# Altium project xecanbang.PrjPcb
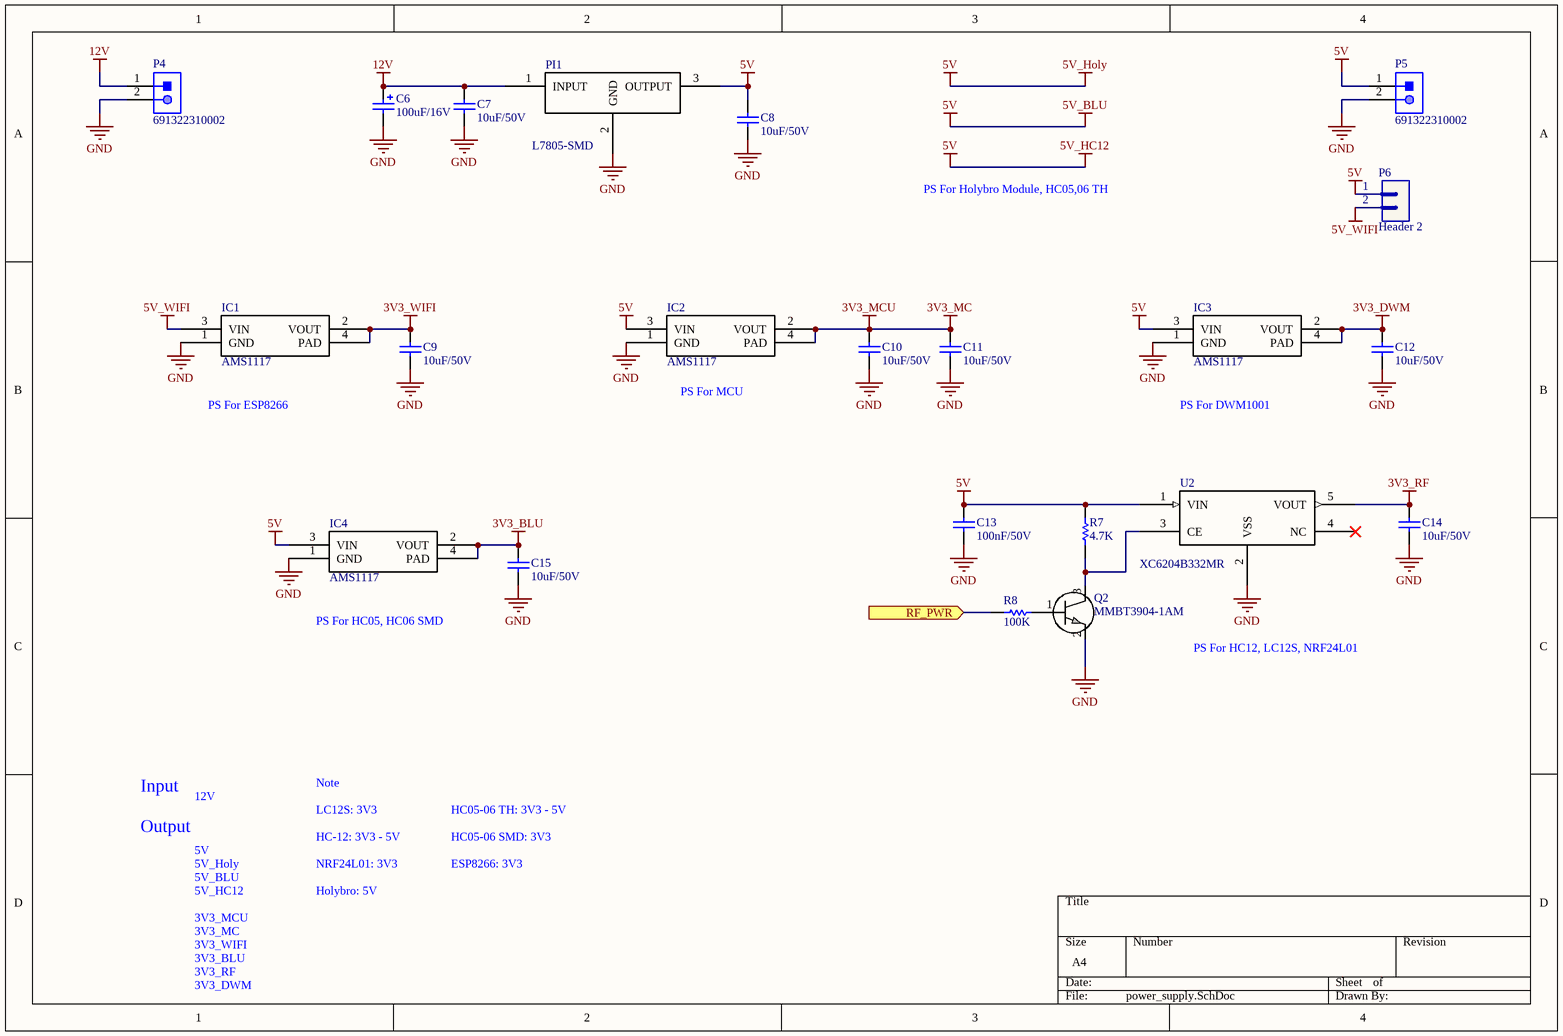
[diagram p0: power_supply.SchDoc]
8 sheets, 147 parts. Net scope: flat (ports and power ports of the same name join across sheets).
Board file: projectxecanbang.PcbDoc
Sheets:
  power_supply.SchDoc
  MCU.SchDoc
  Sensor.SchDoc
  Motor Control.SchDoc
  Bluetooth.SchDoc
  RF.SchDoc
  Decawave.SchDoc
  Wifi.SchDoc

## Sheet power_supply.SchDoc
size A4; DocumentNumber: 1; SheetNumber: 1; SheetTotal: 2

### Parts
(Parts that share a designator on the sheet are numbered #1, #2 ... from top to bottom, then left to right.)
C6  value 100uF/16V  [CAP-SM-AL-SIZE-D-D6L6]  (hidden comment: Cap-Al-100uF-16V-D6L5)
C7  value 10uF/50V  [CAP-SM-0805]  (hidden comment: Cap-10uF-50V-0805)
C8  value 10uF/50V  [CAP-SM-0805]  (hidden comment: Cap-10uF-50V-0805)
C9  value 10uF/50V  [CAP-SM-0805]  (hidden comment: Cap-10uF-50V-0805)
C10  value 10uF/50V  [CAP-SM-0805]  (hidden comment: Cap-10uF-50V-0805)
C11  value 10uF/50V  [CAP-SM-0805]  (hidden comment: Cap-10uF-50V-0805)
C12  value 10uF/50V  [CAP-SM-0805]  (hidden comment: Cap-10uF-50V-0805)
C13  value 100nF/50V  [CAP-SM-0805]  (hidden comment: Cap-100nF-50V-0805)
C14  value 10uF/50V  [CAP-SM-0805]  (hidden comment: Cap-10uF-50V-0805)
C15  value 10uF/50V  [CAP-SM-0805]  (hidden comment: Cap-10uF-50V-0805)
IC1  AMS1117  [SOT223_AMS111700]
IC2  AMS1117  [SOT223_AMS111700]
IC3  AMS1117  [SOT223_AMS111700]
IC4  AMS1117  [SOT223_AMS111700]
P4#1  691322310002  [691322310002]
P5#1  691322310002  [691322310002]
P6#1  Header 2  [JP2]
PI1  L7805-SMD  [D2PAK]
Q2  MMBT3904-1AM  [SOT23_NEX]
R7  value 4.7K  [RES-SM-0805]  (hidden comment: Res-4.7K-0805)
R8  value 100K  [RES-SM-0805]  (hidden comment: Res-100K-0805)
U2  XC6204B332MR  [XC6204/05_SOT-25]

### Ports
RF_PWR (in)

### Nets
3V3_BLU: C15.2 IC4.2(VOUT) IC4.4(PAD)
3V3_DWM: C12.2 IC3.2(VOUT) IC3.4(PAD)
3V3_MC: C10.2 C11.2 IC2.2(VOUT) IC2.4(PAD)  [also labelled 3V3_MCU]
3V3_RF: C14.2 U2.5(VOUT)
3V3_WIFI: C9.2 IC1.2(VOUT) IC1.4(PAD)
5V: C8.2 C13.2 IC2.3(VIN) IC3.3(VIN) IC4.3(VIN) P5#1.1 P6#1.1 PI1.3(OUTPUT) R7.2 U2.1(VIN)  [also labelled 5V_BLU, 5V_HC12, 5V_Holy]
5V_WIFI: IC1.3(VIN) P6#1.2
12V: C6.1 C7.2 P4#1.1 PI1.1(INPUT)
GND: C6.2 C7.1 C8.1 C9.1 C10.1 C11.1 C12.1 C13.1 C14.1 C15.1 IC1.1(GND) IC2.1(GND) IC3.1(GND) IC4.1(GND) P4#1.2 P5#1.2 PI1.2(GND) Q2.2 U2.2(VSS)
NetQ2_1: Q2.1 R8.2
NetQ2_3: Q2.3 R7.1 U2.3(CE)
NetR8_1: R8.1 ; port RF_PWR

Not connected (* = marked no-connect by the designer): U2 4(NC)*

### Notes on the sheet
- PS For Holybro Module, HC05,06 TH
- PS For ESP8266
- (near IC2) PS For MCU
- PS For DWM1001
- PS For HC05, HC06 SMD
- PS For HC12, LC12S, NRF24L01
- Note
- Input
- Output
- 12V
- LC12S: 3V3
- HC-12: 3V3 - 5V
- HC05-06 TH: 3V3 - 5V
- HC05-06 SMD: 3V3
- 5V
  5V_Holy
  5V_BLU
  5V_HC12
- NRF24L01: 3V3
- Holybro: 5V
- ESP8266: 3V3
- 3V3_MCU
  3V3_MC
  3V3_WIFI
  3V3_BLU
  3V3_RF
  3V3_DWM

### Library data of the parts
C6 = Cap-Al-100uF-16V-D6L5: CAP ALUM 100UF 20% 16V SMD; Manufacturer: Nichicon; Manufacturer Part Number: UWX1C101MCL1GB; Local Supplier: thegioiic; Local Supplier Link: https://thegioiic.com/products/tu-nhom-smd-100uf-16v-d6-3l5-4; Supplier 1: Digikey; Supplier 1 Part Number: 493-2105-1-ND; Supplier 1 Link: https://www.digikey.com/product-detail/en/nichicon/UWX1C101MCL1GB/493-2105-1-ND/590080
C7-C12 C14 C15 = Cap-10uF-50V-0805: CAP CER 10UF 50V X5R 0805; Manufacturer: Yageo; Manufacturer Part Number: CC0805KKX5R9BB106; Local Supplier: thegioiic; Local Supplier Link: https://thegioiic.com/products/tu-10uf-50v-0805; Supplier 1: Digikey; Supplier 1 Link: https://www.digikey.com/product-detail/en/yageo/CC0805KKX5R9BB106/311-3499-2-ND/7164383; Supplier 1 Part Number: 311-3499-2-ND
C13 = Cap-100nF-50V-0805: CAP CER 0.1UF 50V Y5V 0805; Manufacturer: Samsung Electro-Mechanics; Manufacturer Part Number: CL21F104ZBCNNNC; Local Supplier: thegioiic; Local Supplier Link: https://thegioiic.com/products/tu-100nf-0-1uf-50v-0805; Supplier 1: Digikey; Supplier 1 Part Number: 1276-1007-1-ND; Supplier 1 Link: https://www.digikey.com/product-detail/en/samsung-electro-mechanics/CL21F104ZBCNNNC/1276-1007-1-ND/3889093
IC1-IC4 = AMS1117: Manufacturer_Part_Number: AMS1117-5.0; SourceLibrary: Advanced_Monolithic_Systems_2020-02-13; Built_By: EMA_Kyle; Vendor: Advanced Monolithic Systems; Copyright: Copyright (C) 2018 Accelerated Designs. All rights reserved; RefDes: RefDes; Type: DEV
P4#1 P5#1 = 691322310002: WR-TBL Serie 322 Horizontal PCB Header, Pluggable, pitch 3.81mm, 2p; Compliance: RoHS; Modularity: No; Pin Number: 2; Rated Current [UL]: 10A; Working Voltage [UL]: 300VAC; ComponentLink1Description: Manufacturer; ComponentLink1URL: http://www.we-online.de; ComponentLink2URL: https://katalog.we-online.de/em/datasheet/691322310002.pdf; ComponentLink2Description: Datasheet; Mounting Technology: THT; Part Number: 691322310002; Packaging: Box; Operating Temperature: -40 to +105degC; PCB/Cable/Panel: PCB; Pitch: 3.81mm; Published Date: October 2019; Type: Horizontal; Publisher: Wurth Elektronik; Application: Pluggable
P6#1 = Header 2: Header, 2-Pin; LatestRevisionDate: 17-Jul-2002; LatestRevisionNote: Re-released for DXP Platform.; Publisher: Altium Limited
PI1 = L7805-SMD: Manufacturer_Part_Number: L7805CD2T-TR; Vendor: STMicroelectronics; Built_By: EMA_UL_Team; Copyright: Copyright (C) 2018 Accelerated Designs. All rights reserved; RefDes: RefDes; Type: DEV
Q2 = MMBT3904-1AM: Vendor: Nexperia; SourceLibrary: Nexperia_2018-05-2018; Type: DEV; Manufacturer_Part_Number: MMBT3904; Copyright: Copyright (C) 2016 Accelerated Designs. All rights reserved; RefDes: RefDes
R7 = Res-4.7K-0805: RES SMD 4.7K OHM 5% 1/8W 0805; Manufacturer: Yageo; Manufacturer Part Number: RC0805JR-074K7L; Local Supplier: thegioiic; Local Supplier Link: https://thegioiic.com/products/dien-tro-4-7k-ohm-0805-5; Supplier 1: Digikey; Supplier 1 Link: https://www.digikey.com/product-detail/en/yageo/RC0805JR-074K7L/311-4.7KARCT-ND/731274; Supplier 1 Part Number: 311-4.7KARCT-ND
R8 = Res-100K-0805: RES 0 OHM JUMPER 0805; Manufacturer: Vishay Dale; Manufacturer Part Number: WSL080500000ZEA9; Local Supplier: thegioiic; Local Supplier Link: https://thegioiic.com/products/dien-tro-0-ohm-0805-5; Supplier 1: Digikey; Supplier 1 Link: https://www.digikey.com/product-detail/en/vishay-dale/WSL080500000ZEA9/541-3928-1-ND/7423223; Supplier 1 Part Number: 541-3928-1-ND
U2 = XC6204B332MR: Vendor: Torex Semiconductor; Built_By: EMA_UL_Team; SourceLibrary: Torex_2016-07-05_1; Manufacturer_Part_Number: XC6204B332MR; Copyright: Copyright (C) 2018 Accelerated Designs. All rights reserved; RefDes: RefDes; Type: DEV

## Sheet MCU.SchDoc
size A4; DocumentNumber: 2; SheetNumber: 2; SheetTotal: 2
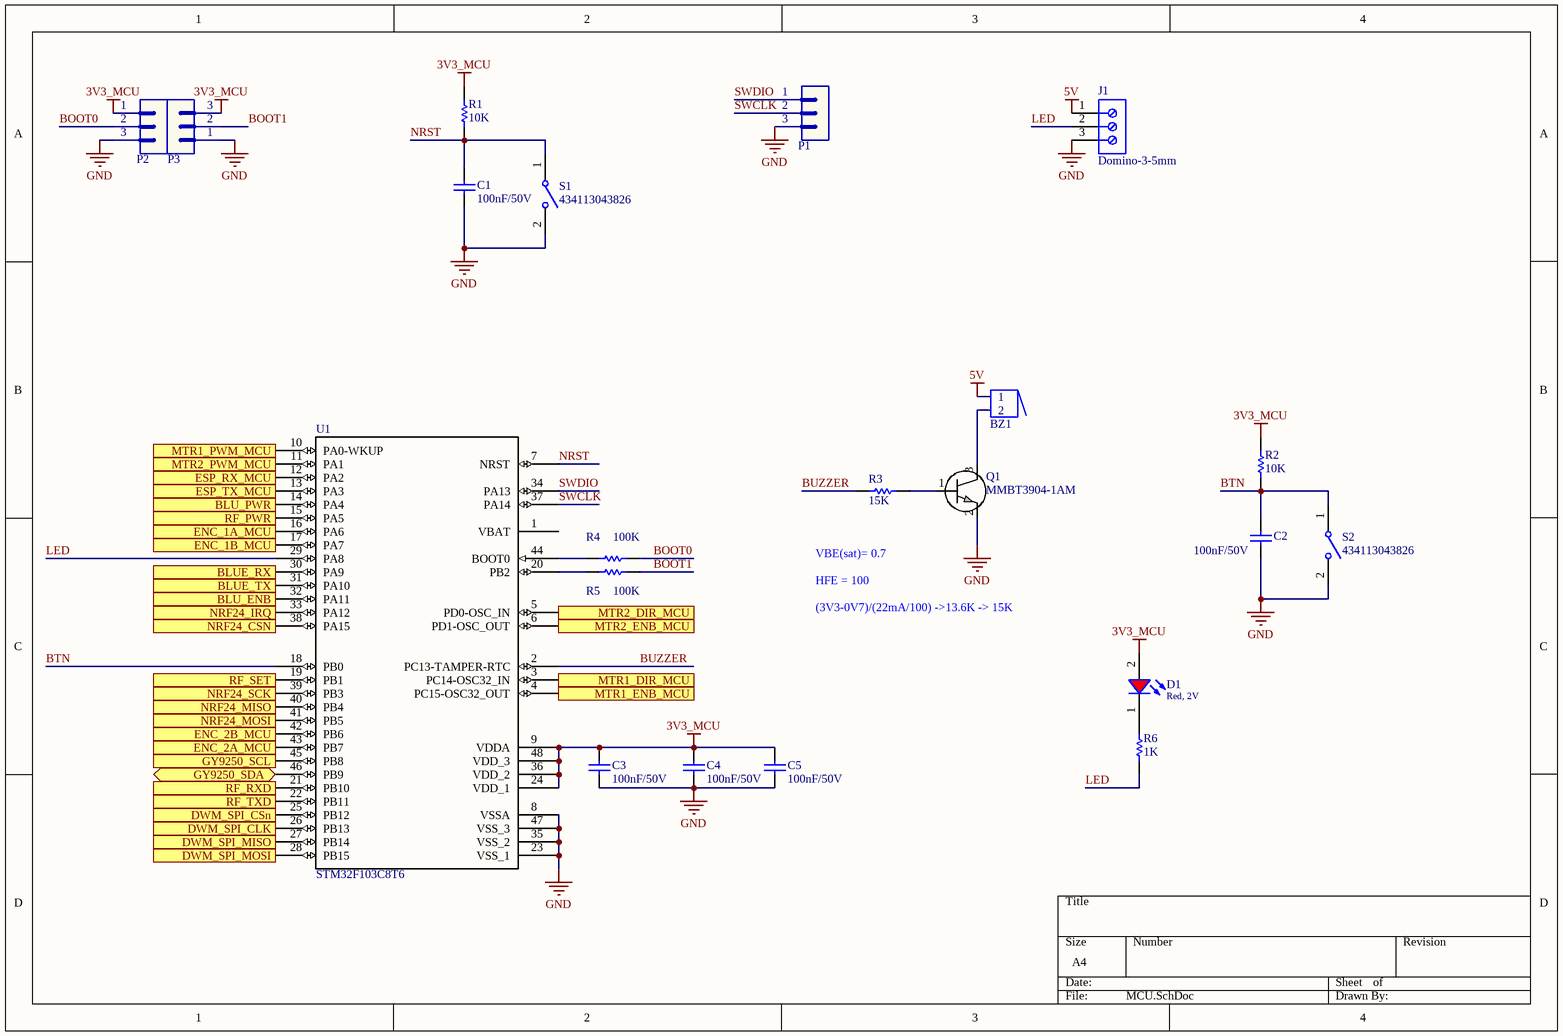
[diagram p1: MCU.SchDoc]

### Parts
BZ1  Buzzer  [BUZZER]  (value not drawn)
C1  value 100nF/50V  [CAP-SM-0805]  (hidden comment: Cap-100nF-50V-0805)
C2  value 100nF/50V  [CAP-SM-0805]  (hidden comment: Cap-100nF-50V-0805)
C3  value 100nF/50V  [CAP-SM-0805]  (hidden comment: Cap-100nF-50V-0805)
C4  value 100nF/50V  [CAP-SM-0805]  (hidden comment: Cap-100nF-50V-0805)
C5  value 100nF/50V  [CAP-SM-0805]  (hidden comment: Cap-100nF-50V-0805)
D1  Red, 2V  [WL-SMCW_0805]
J1  Domino-3-5mm  [DOMINO-3-5mm]
P1  Header 3  [JP3]  (value not drawn)
P2  Header 3  [JP3]  (value not drawn)
P3  Header 3  [JP3]  (value not drawn)
Q1  MMBT3904-1AM  [SOT23_NEX]
R1  value 10K  [RES-SM-0805]  (hidden comment: Res-10k-0805)
R2  value 10K  [RES-SM-0805]  (hidden comment: Res-10k-0805)
R3  value 15K  [RES-SM-0805]  (hidden comment: Res-15K-0805)
R4  value 100K  [RES-SM-0805]  (hidden comment: Res-100K-0805)
R5  value 100K  [RES-SM-0805]  (hidden comment: Res-100K-0805)
R6  value 1K  [RES-SM-0805]  (hidden comment: Res-1K-0805)
S1  434113043826  [434113043826]
S2  434113043826  [434113043826]
U1  STM32F103C8T6  [STM32F103T8C6]

### Ports
BLU_ENB (out), BLU_PWR (out), BLUE_RX (out), BLUE_TX (in), DWM_SPI_CLK (out), DWM_SPI_CSn (out), DWM_SPI_MISO (in), DWM_SPI_MOSI (out), ENC_1A_MCU (in), ENC_1B_MCU (in), ENC_2A_MCU (in), ENC_2B_MCU (in), ESP_RX_MCU (out), ESP_TX_MCU (in), GY9250_SCL (out), GY9250_SDA (bidir), MTR1_DIR_MCU (out), MTR1_ENB_MCU (out), MTR1_PWM_MCU (out), MTR2_DIR_MCU (out), MTR2_ENB_MCU (out), MTR2_PWM_MCU (out), NRF24_CSN (out), NRF24_IRQ (in), NRF24_MISO (in), NRF24_MOSI (out), NRF24_SCK (out), RF_PWR (out), RF_RXD (out), RF_SET (out), RF_TXD (in)

### Nets
3V3_MCU: C3.1 C4.1 C5.1 D1.2(A) P2.1 P3.3 R1.1 R2.2 U1.9(VDDA) U1.24(VDD_1) U1.36(VDD_2) U1.48(VDD_3)  [project net 3V3_MC]
5V: BZ1.1 J1.1
GND: C1.1 C2.1 C3.2 C4.2 C5.2 J1.3 P1.3 P2.3 P3.1 Q1.2 S1.2 S2.2 U1.8(VSSA) U1.23(VSS_1) U1.35(VSS_2) U1.47(VSS_3)
BOOT0: P2.2 R4.2
BOOT1: P3.2 R5.2
BTN: C2.2 R2.1 S2.1 U1.18(PB0)
BUZZER: R3.1 U1.2(PC13-TAMPER-RTC)
DWM_SPI_CLK: U1.26(PB13) ; port DWM_SPI_CLK
DWM_SPI_CSn: U1.25(PB12) ; port DWM_SPI_CSn
DWM_SPI_MISO: U1.27(PB14) ; port DWM_SPI_MISO
DWM_SPI_MOSI: U1.28(PB15) ; port DWM_SPI_MOSI
ESP_TX: U1.13(PA3) ; port ESP_TX_MCU
LED: J1.2 R6.2 U1.29(PA8)
NRST: C1.2 R1.2 S1.1 U1.7(NRST)
RF_RXD: U1.21(PB10) ; port RF_RXD
RF_SET: U1.19(PB1) ; port RF_SET
RF_TXD: U1.22(PB11) ; port RF_TXD
SWCLK: P1.2 U1.37(PA14)
SWDIO: P1.1 U1.34(PA13)
NetBZ1_2: BZ1.2 Q1.3
NetD1_1: D1.1(K) R6.1
NetH1_2: U1.30(PA9) ; port BLUE_RX
NetH1_3: U1.31(PA10) ; port BLUE_TX
NetH1_6: U1.32(PA11) ; port BLU_ENB
NetM1_3: U1.45(PB8) ; port GY9250_SCL
NetM1_4: U1.46(PB9) ; port GY9250_SDA
NetM6_4: U1.38(PA15) ; port NRF24_CSN
NetM6_5: U1.39(PB3) ; port NRF24_SCK
NetM6_6: U1.41(PB5) ; port NRF24_MOSI
NetM6_7: U1.40(PB4) ; port NRF24_MISO
NetM6_8: U1.33(PA12) ; port NRF24_IRQ
NetQ1_1: Q1.1 R3.2
NetR4_1: R4.1 U1.44(BOOT0)
NetR5_1: R5.1 U1.20(PB2)
NetR8_1: U1.15(PA5) ; port RF_PWR
NetR27_1: U1.12(PA2) ; port ESP_RX_MCU
NetU1_3: U1.3(PC14-OSC32_IN) ; port MTR1_DIR_MCU
NetU1_4: U1.4(PC15-OSC32_OUT) ; port MTR1_ENB_MCU
NetU1_5: U1.5(PD0-OSC_IN) ; port MTR2_DIR_MCU
NetU1_6: U1.6(PD1-OSC_OUT) ; port MTR2_ENB_MCU
NetU1_10: U1.10(PA0-WKUP) ; port MTR1_PWM_MCU
NetU1_11: U1.11(PA1) ; port MTR2_PWM_MCU
NetU1_14: U1.14(PA4) ; port BLU_PWR
NetU1_16: U1.16(PA6) ; port ENC_1A_MCU
NetU1_17: U1.17(PA7) ; port ENC_1B_MCU
NetU1_42: U1.42(PB6) ; port ENC_2B_MCU
NetU1_43: U1.43(PB7) ; port ENC_2A_MCU

Not connected (* = marked no-connect by the designer): U1 1(VBAT)

### Notes on the sheet
- VBE(sat)= 0.7
- HFE = 100
- (3V3-0V7)/(22mA/100) ->13.6K -> 15K

### Library data of the parts
C1-C5 = Cap-100nF-50V-0805: as C13 on sheet power_supply; Local Supplier: thegioiic; Local Supplier Link: https://thegioiic.com/products/tu-100nf-0-1uf-50v-0805; Supplier 1: Digikey; Supplier 1 Part Number: 1276-1007-1-ND; Supplier 1 Link: https://www.digikey.com/product-detail/en/samsung-electro-mechanics/CL21F104ZBCNNNC/1276-1007-1-ND/3889093
D1 = 150080RS75000: WL-SMCW SMT Mono-color Chip LED Waterclear, size 0805, Red, 2V, 140deg; Chip Technology: AlInGaP; Dominant Wavelength typ.: 625nm; Luminous Intensity typ.: 150mcd; Peak Wavelength typ.: 630nm; Viewing Angle: 140deg; ComponentLink1Description: Manufacturer; ComponentLink1URL: http://www.we-online.de; ComponentLink2URL: https://www.we-online.com/catalog/datasheet/150080RS75000.pdf; ComponentLink2Description: Datasheet; Forward Voltage typ.: 2V; Emitting Color: Red; Mounting Technology: SMT; Operating Temperature: -40 to +85degC; Published Date: December 2019; Part Number: 150080RS75000; Packaging: Tape and Reel; Size: 0805; Publisher: Wurth Elektronik
J1 = Domino-3-5mm: WR-TBL Serie 1347 Horizontal Cable Entry, Pressure Clamp, pitch 5mm, 3p; Part Number: 691134710003; Compliance: Lead free / RoHS; Modularity: Yes; PCB/Cable/Panel: PCB; Pin Number: 3; Rated Current [UL]: 16A; Working Voltage [UL]: 300VAC; ComponentLink1Description: Manufacturer; ComponentLink1URL: http://www.we-online.de; ComponentLink2URL: https://katalog.we-online.de/em/datasheet/691134710003.pdf; ComponentLink2Description: Datasheet; Mounting Technology: THT; Packaging: Box; Operating Temperature: -30 to +120degC; Pitch: 5mm; Published Date: October 2019; Type: Horizontal; Publisher: Wurth Elektronik; Application: Pressure Clamp
P1-P3 = Header 3: Header, 3-Pin; LatestRevisionDate: 17-Jul-2002; LatestRevisionNote: Re-released for DXP Platform.; Publisher: Altium Limited
Q1 = MMBT3904-1AM: as Q2 on sheet power_supply; Manufacturer_Part_Number: MMBT3904; Copyright: Copyright (C) 2016 Accelerated Designs. All rights reserved; RefDes: RefDes
R1 R2 = Res-10k-0805: RES 10K OHM 1% 1/4W 0805; Manufacturer: Stackpole Electronics Inc; Manufacturer Part Number: RNCP0805FTD10K0; Local Supplier: thegioiic; Local Supplier Link: https://thegioiic.com/products/dien-tro-10k-ohm-0805-5; Supplier 1: Digikey; Supplier 1 Link: https://www.digikey.com/product-detail/en/stackpole-electronics-inc/RNCP0805FTD10K0/RNCP0805FTD10K0CT-ND/2240601; Supplier 1 Part Number: RNCP0805FTD10K0CT-ND
R3 = Res-15K-0805: RES 15K OHM 1% 1/4W 0805; Manufacturer: TE Connectivity Passive Product; Manufacturer Part Number: CRGCQ0805F15K; Local Supplier: thegioiic; Local Supplier Link: https://thegioiic.com/products/dien-tro-15k-ohm-0805-1; Supplier 1: Digikey; Supplier 1 Part Number: A129763CT-ND; Supplier 1 Link: https://www.digikey.com/product-detail/en/te-connectivity-passive-product/CRGCQ0805F15K/A129763CT-ND/8577595
R4 R5 = Res-100K-0805: as R8 on sheet power_supply; Local Supplier: thegioiic; Local Supplier Link: https://thegioiic.com/products/dien-tro-0-ohm-0805-5; Supplier 1: Digikey; Supplier 1 Link: https://www.digikey.com/product-detail/en/vishay-dale/WSL080500000ZEA9/541-3928-1-ND/7423223; Supplier 1 Part Number: 541-3928-1-ND
R6 = Res-1K-0805: RES 1K OHM 1% 1/4W 0805; Manufacturer: Stackpole Electronics Inc; Manufacturer Part Number: RNCP0805FTD1K00; Local Supplier: thegioiic; Local Supplier Link: https://thegioiic.com/products/dien-tro-1k-ohm-0805-5; Supplier 1: Digikey; Supplier 1 Link: https://www.digikey.com/product-detail/en/stackpole-electronics-inc/RNCP0805FTD1K00/RNCP0805FTD1K00CT-ND/2240568; Supplier 1 Part Number: RNCP0805FTD1K00CT-ND
S1 S2 = 434113043826: WS-TASV J-Bend SMT Tact Switch 6x3.5mm, height 4.3mm, 260gf; Rated Voltage: 12VDC; Rated Current: 50mA; Washable: No; ComponentLink1Description: Manufacturer; ComponentLink1URL: http://www.we-online.de; ComponentLink2Description: Datasheet; ComponentLink2URL: https://katalog.we-online.com/em/datasheet/434113043826.pdf; Operating Temperature: -40 to +85degC; Part Number: 434113043826; Published Date: September 2019; Contact Material: Stainless Steel; Height: 4.3mm; Mounting Technology: SMT; Contact Plating: Silver; Operation Force: 260gf; Packaging: Tape and Reel; Terminal Material: Copper Alloy; Publisher: Wurth Elektronik; Terminal Plating: Silver
U1 = STM32F103C8T6: Vendor: STMicroelectronics; Built_By: EMA_UL_Team; Manufacturer_Part_Number: STM32F103C8T6; Copyright: Copyright (C) 2018 Accelerated Designs. All rights reserved; RefDes: RefDes; Type: DEV

## Sheet Sensor.SchDoc
size A4
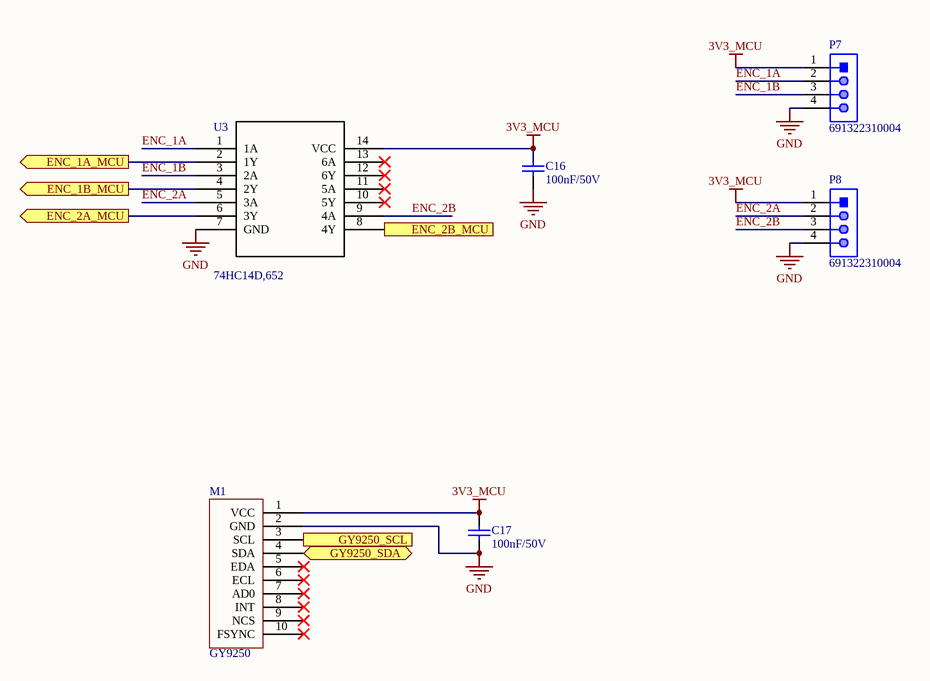
[diagram p2: Sensor.SchDoc]

### Parts
(Parts that share a designator on the sheet are numbered #1, #2 ... from top to bottom, then left to right.)
C16  value 100nF/50V  [CAP-SM-0805]  (hidden comment: Cap-100nF-50V-0805)
C17  value 100nF/50V  [CAP-SM-0805]  (hidden comment: Cap-100nF-50V-0805)
M1  GY9250  [GY9250]
P7#1  691322310004  [691322310004]
P8#1  691322310004  [691322310004]
U3  74HC14D,652  [74HC14D,652]

### Ports
ENC_1A_MCU (out), ENC_1B_MCU (out), ENC_2A_MCU (out), ENC_2B_MCU (out), GY9250_SCL (in), GY9250_SDA (bidir)

### Nets
3V3_MCU: C16.2 C17.2 M1.1(VCC) P7#1.1 P8#1.1 U3.14(VCC)  [project net 3V3_MC]
GND: C16.1 C17.1 M1.2(GND) P7#1.4 P8#1.4 U3.7(GND)
ENC_1A: P7#1.2 U3.1(1A)
ENC_1B: P7#1.3 U3.3(2A)
ENC_2A: P8#1.2 U3.5(3A)
ENC_2B: P8#1.3 U3.9(4A)
NetM1_3: M1.3(SCL) ; port GY9250_SCL
NetM1_4: M1.4(SDA) ; port GY9250_SDA
NetU1_16: U3.2(1Y) ; port ENC_1A_MCU
NetU1_17: U3.4(2Y) ; port ENC_1B_MCU
NetU1_42: U3.8(4Y) ; port ENC_2B_MCU
NetU1_43: U3.6(3Y) ; port ENC_2A_MCU

Not connected (* = marked no-connect by the designer): M1 5(EDA)* 6(ECL)* 7(AD0)* 8(INT)* 9(NCS)* 10(FSYNC)*; U3 10(5Y)* 11(5A)* 12(6Y)* 13(6A)*

### Library data of the parts
C16 C17 = Cap-100nF-50V-0805: as C13 on sheet power_supply; Local Supplier: thegioiic; Local Supplier Link: https://thegioiic.com/products/tu-100nf-0-1uf-50v-0805; Supplier 1: Digikey; Supplier 1 Part Number: 1276-1007-1-ND; Supplier 1 Link: https://www.digikey.com/product-detail/en/samsung-electro-mechanics/CL21F104ZBCNNNC/1276-1007-1-ND/3889093
P7#1 P8#1 = 691322310004: WR-TBL Serie 322 Horizontal PCB Header, Pluggable, pitch 3.81mm, 4p; Compliance: RoHS; Modularity: No; Pin Number: 4; Rated Current [UL]: 10A; Working Voltage [UL]: 300VAC; ComponentLink1Description: Manufacturer; ComponentLink1URL: http://www.we-online.de; ComponentLink2URL: https://katalog.we-online.de/em/datasheet/691322310004.pdf; ComponentLink2Description: Datasheet; Mounting Technology: THT; Part Number: 691322310004; Packaging: Box; Operating Temperature: -40 to +105degC; PCB/Cable/Panel: PCB; Pitch: 3.81mm; Published Date: October 2019; Type: Horizontal; Publisher: Wurth Elektronik; Application: Pluggable
U3 = 74HC14D,652: Vendor: Nexperia; SourceLibrary: Nexperia_2018-05-2018; Manufacturer_Part_Number: 74HC14D,652; Copyright: Copyright (C) 2016 Accelerated Designs. All rights reserved; RefDes: RefDes; Type: DEV
M1 = GY9250: Local Supplier: HShop; Local Supplier Link: https://hshop.vn/products/cam-bien-gy-9250-9dof-imu-mpu9250; Local Supplier Part Number: *; Manufacturer: *; Manufacturer Part Number: *

## Sheet Motor Control.SchDoc
size A4
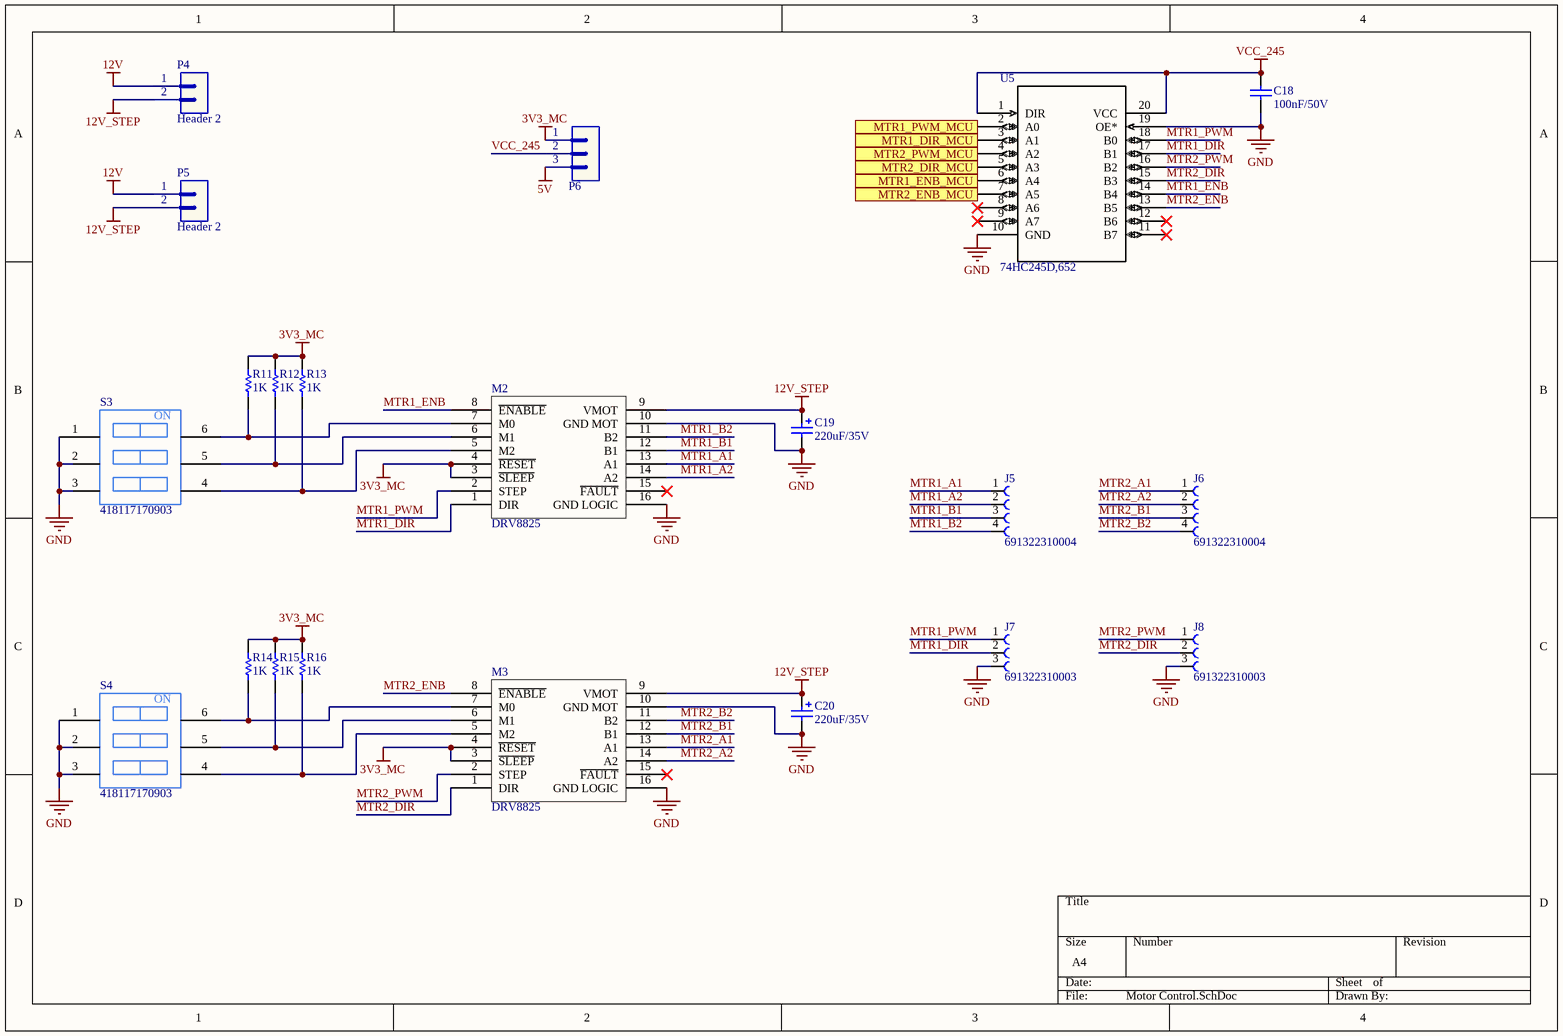
[diagram p3: Motor Control.SchDoc]

### Parts
(Parts that share a designator on the sheet are numbered #1, #2 ... from top to bottom, then left to right.)
C18  value 100nF/50V  [CAP-SM-0805]  (hidden comment: Cap-100nF-50V-0805)
C19  value 220uF/35V  [CAP-SM-AL-SIZE-F-D8L10]  (hidden comment: Cap-Al-220uF-35V-D8L10)
C20  value 220uF/35V  [CAP-SM-AL-SIZE-F-D8L10]  (hidden comment: Cap-Al-220uF-35V-D8L10)
J5  691322310004  [691322310004]
J6  691322310004  [691322310004]
J7  691322310003  [691322310003]
J8  691322310003  [691322310003]
M2  DRV8825  [DRV8825]
M3  DRV8825  [DRV8825]
P4#2  Header 2  [JP2]
P5#2  Header 2  [JP2]
P6#2  Header 3  [JP3]  (value not drawn)
R11  value 1K  [RES-SM-0805]  (hidden comment: Res-1K-0805)
R12  value 1K  [RES-SM-0805]  (hidden comment: Res-1K-0805)
R13  value 1K  [RES-SM-0805]  (hidden comment: Res-1K-0805)
R14  value 1K  [RES-SM-0805]  (hidden comment: Res-1K-0805)
R15  value 1K  [RES-SM-0805]  (hidden comment: Res-1K-0805)
R16  value 1K  [RES-SM-0805]  (hidden comment: Res-1K-0805)
S3  418117170903  [418117170903]
S4  418117170903  [418117170903]
U5  74HC245D,652  [74HC245D-652]

### Ports
MTR1_DIR_MCU (in), MTR1_ENB_MCU (in), MTR1_PWM_MCU (in), MTR2_DIR_MCU (in), MTR2_ENB_MCU (in), MTR2_PWM_MCU (in)

### Nets
3V3_MC: M2.3(~{SLEEP}) M2.4(~{RESET}) M3.3(~{SLEEP}) M3.4(~{RESET}) P6#2.1 R11.2 R12.2 R13.2 R14.2 R15.2 R16.2
5V: P6#2.3
12V: P4#2.1 P5#2.1
12V_STEP: C19.1 C20.1 M2.9(VMOT) M3.9(VMOT) P4#2.2 P5#2.2
GND: C18.1 C19.2 C20.2 J7.3 J8.3 M2.10(GND_MOT) M2.16(GND_LOGIC) M3.10(GND_MOT) M3.16(GND_LOGIC) U5.10(GND) U5.19(OE*)
VCC_245: C18.2 P6#2.2 U5.1(DIR) U5.20(VCC)
MTR1_A1: J5.1 M2.13(A1)
MTR1_A2: J5.2 M2.14(A2)
MTR1_B1: J5.3 M2.12(B1)
MTR1_B2: J5.4 M2.11(B2)
MTR1_DIR: J7.2 M2.1(DIR) U5.17(B1)
MTR1_ENB: M2.8(~{ENABLE}) U5.14(B4)
MTR1_PWM: J7.1 M2.2(STEP) U5.18(B0)
MTR2_A1: J6.1 M3.13(A1)
MTR2_A2: J6.2 M3.14(A2)
MTR2_B1: J6.3 M3.12(B1)
MTR2_B2: J6.4 M3.11(B2)
MTR2_DIR: J8.2 M3.1(DIR) U5.15(B3)
MTR2_ENB: M3.8(~{ENABLE}) U5.13(B5)
MTR2_PWM: J8.1 M3.2(STEP) U5.16(B2)
NetM2_5: M2.5(M2) R13.1
NetM2_6: M2.6(M1) R12.1
NetM2_7: M2.7(M0) R11.1
NetM3_5: M3.5(M2) R16.1
NetM3_6: M3.6(M1) R15.1
NetM3_7: M3.7(M0) R14.1
NetU1_3: U5.3(A1) ; port MTR1_DIR_MCU
NetU1_4: U5.6(A4) ; port MTR1_ENB_MCU
NetU1_5: U5.5(A3) ; port MTR2_DIR_MCU
NetU1_6: U5.7(A5) ; port MTR2_ENB_MCU
NetU1_10: U5.2(A0) ; port MTR1_PWM_MCU
NetU1_11: U5.4(A2) ; port MTR2_PWM_MCU

Not connected (* = marked no-connect by the designer): M2 15(~{FAULT})*; M3 15(~{FAULT})*; S3 1 2 3 4 5 6; S4 1 2 3 4 5 6; U5 8(A6)* 9(A7)* 11(B7)* 12(B6)*

### Notes on the sheet
- (in symbol 418117170903) ON

### Library data of the parts
C18 = Cap-100nF-50V-0805: as C13 on sheet power_supply; Local Supplier: thegioiic; Local Supplier Link: https://thegioiic.com/products/tu-100nf-0-1uf-50v-0805; Supplier 1: Digikey; Supplier 1 Part Number: 1276-1007-1-ND; Supplier 1 Link: https://www.digikey.com/product-detail/en/samsung-electro-mechanics/CL21F104ZBCNNNC/1276-1007-1-ND/3889093
C19 C20 = Cap-Al-220uF-35V-D8L10: CAP ALUM 220UF 20% 35V SMD; Manufacturer: Nichicon; Manufacturer Part Number: UWT1V221MNL1GS; Local Supplier: thegioiic; Local Supplier Link: https://thegioiic.com/products/tu-nhom-smd-220uf-35v-d8l10; Supplier 1: Digikey; Supplier 1 Link: https://www.digikey.com/product-detail/en/nichicon/UWT1V221MNL1GS/493-2205-2-ND/589946; Supplier 1 Part Number: 493-2205-2-ND
J5 J6 = 691322310004: 4 Position Terminal Block Header, Male Pins, Shrouded (4 Side) 0.150 (3.81mm) 90Â°, Right Angle Through Hole; MF: Wurth Electronics; Package: None; DigiKey-Purchase-URL: https://snapeda.com/shop?store=DigiKey&id=1195122; Value: *; MP: 691322310004; Availability: Unavailable; SnapEDA_Link: https://www.snapeda.com/parts/691322310004/Wurth%20Electronics%20Inc./view-part/1195122/?ref=snap; Price: None
J7 J8 = 691322310003: 3 Position Terminal Block Header, Male Pins, Shrouded _4 Side_ 0.150 _3.81mm_ 90Â°, Right Angle Through Hole; MF: Wurth Electronics; Availability: Unavailable; SnapEDA_Link: https://www.snapeda.com/parts/691322310003/Wurth%20Electronics%20Inc./view-part/1195121/?ref=snap; MP: 691322310003; Price: None; Package: None; DigiKey-Purchase-URL: https://snapeda.com/shop?store=DigiKey&id=1195121; Value: *
P4#2 P5#2 = Header 2: Header, 2-Pin; LatestRevisionDate: 17-Jul-2002; LatestRevisionNote: Re-released for DXP Platform.; Publisher: Altium Limited
P6#2 = Header 3: Header, 3-Pin; LatestRevisionDate: 17-Jul-2002; LatestRevisionNote: Re-released for DXP Platform.; Publisher: Altium Limited
R11-R16 = Res-1K-0805: as R6 on sheet MCU; Local Supplier: thegioiic; Local Supplier Link: https://thegioiic.com/products/dien-tro-1k-ohm-0805-5; Supplier 1: Digikey; Supplier 1 Link: https://www.digikey.com/product-detail/en/stackpole-electronics-inc/RNCP0805FTD1K00/RNCP0805FTD1K00CT-ND/2240568; Supplier 1 Part Number: RNCP0805FTD1K00CT-ND
U5 = 74HC245D,652: Vendor: Nexperia; SourceLibrary: Nexperia_2018-05-2018; Manufacturer_Part_Number: 74HC245D,652; Copyright: Copyright (C) 2016 Accelerated Designs. All rights reserved; RefDes: RefDes; Type: DEV
M2 M3 = DRV8825: Local Supplier: NShop; Local Supplier Link: https://nshopvn.com/product/mach-dieu-khien-dong-co-buoc-drv8825/?gclid=Cj0KCQjwrIf3BRD1ARIsAMuugNvhHaPvOoXKOe7yuk1AcgXaHXv0JlSPYKOD4P10-tIEuNTPRK5zkgEaAjhjEALw_wcB; Local Supplier Part Number: *; Manufacturer: *; Manufacturer Part Number: *
S3 S4 = 418117170903: Manufacturer Part Number: *; Local Supplier Link: https://www.thegioiic.com/products/cong-tac-3-bit-dip-switch-xuyen-lo-2-54mm-mau-do; Local Supplier Part Number: *; Manufacturer: *; Local Supplier: thegioiic

## Sheet Bluetooth.SchDoc
size A4
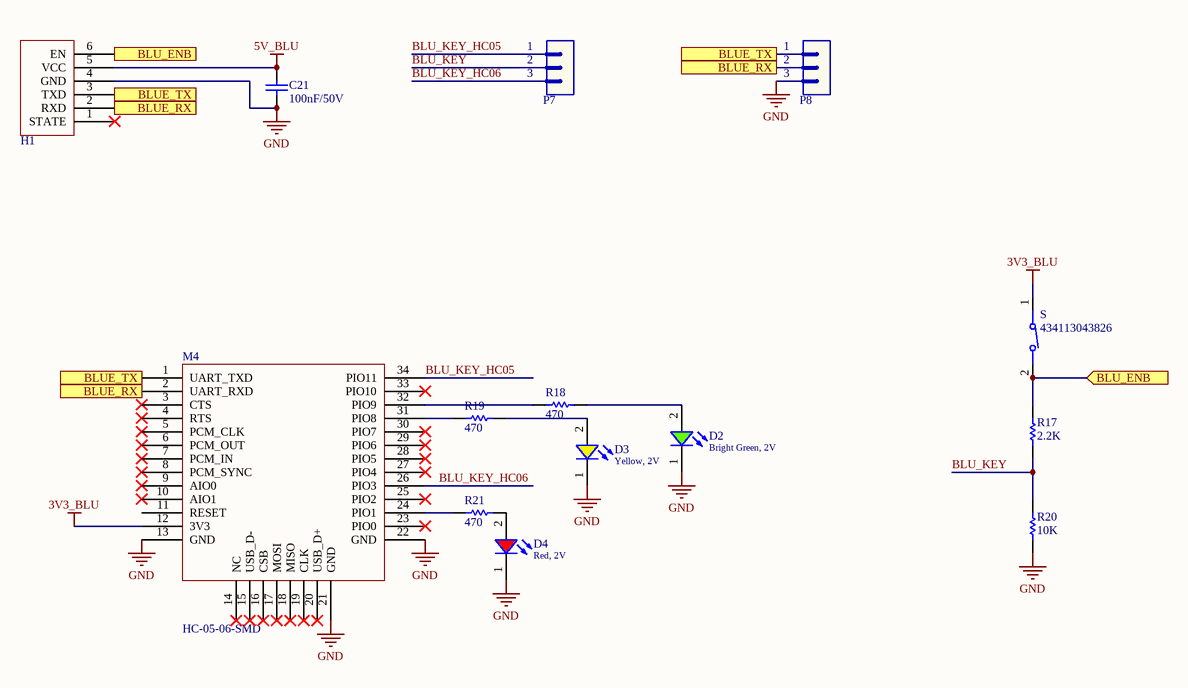
[diagram p4: Bluetooth.SchDoc]

### Parts
(Parts that share a designator on the sheet are numbered #1, #2 ... from top to bottom, then left to right.)
C21  value 100nF/50V  [CAP-SM-0805]  (hidden comment: Cap-100nF-50V-0805)
D2  Bright Green, 2V  [WL-SMCW_0805]
D3  Yellow, 2V  [WL-SMCW_0805]
D4  Red, 2V  [WL-SMCW_0805]
H1  HC-05-06-TH  [HC-05-06-TH]  (value not drawn)
M4  HC-05-06-SMD  [HC-05-06-SMD]
P7#2  Header 3  [JP3]  (value not drawn)
P8#2  Header 3  [JP3]  (value not drawn)
R17  value 2.2K  [RES-SM-0805]  (hidden comment: Res-2.2K-0805)
R18  value 470  [RES-SM-0805]  (hidden comment: Res-470-0805)
R19  value 470  [RES-SM-0805]  (hidden comment: Res-470-0805)
R20  value 10K  [RES-SM-0805]  (hidden comment: Res-10k-0805)
R21  value 470  [RES-SM-0805]  (hidden comment: Res-470-0805)
S#1  434113043826  [434113043826]

### Ports
BLU_ENB (in), BLU_ENB (out), BLUE_RX (in), BLUE_RX (out), BLUE_TX (in)

### Nets
3V3_BLU: M4.12(3V3) S#1.1
5V_BLU: C21.2 H1.5(VCC)  [project net 5V]
GND: C21.1 D2.1(K) D3.1(K) D4.1(K) H1.4(GND) M4.13(GND) M4.21(GND) M4.22(GND) P8#2.3 R20.1
BLU_KEY: P7#2.2 R17.1 R20.2
BLU_KEY_HC05: M4.34(PIO11) P7#2.1
BLU_KEY_HC06: M4.26(PIO3) P7#2.3
NetD2_2: D2.2(A) R18.2
NetD3_2: D3.2(A) R19.2
NetD4_2: D4.2(A) R21.2
NetH1_2: H1.2(RXD) M4.2(UART_RXD) P8#2.2 ; port BLUE_RX
NetH1_3: H1.3(TXD) M4.1(UART_TXD) P8#2.1 ; port BLUE_TX
NetH1_6: H1.6(EN) R17.2 S#1.2 ; port BLU_ENB
NetM4_24: M4.24(PIO1) R21.1
NetM4_31: M4.31(PIO8) R19.1
NetM4_32: M4.32(PIO9) R18.1

Not connected (* = marked no-connect by the designer): H1 1(STATE)*; M4 3(CTS)* 4(RTS)* 5(PCM_CLK)* 6(PCM_OUT)* 7(PCM_IN)* 8(PCM_SYNC)* 9(AIO0)* 10(AIO1)* 11(RESET) 14(NC)* 15(USB_D-)* 16(CSB)* 17(MOSI)* 18(MISO)* 19(CLK)* 20(USB_D+)* 23(PIO0)* 25(PIO2)* 27(PIO4)* 28(PIO5)* 29(PIO6)* 30(PIO7)* 33(PIO10)*

### Library data of the parts
C21 = Cap-100nF-50V-0805: as C13 on sheet power_supply; Local Supplier: thegioiic; Local Supplier Link: https://thegioiic.com/products/tu-100nf-0-1uf-50v-0805; Supplier 1: Digikey; Supplier 1 Part Number: 1276-1007-1-ND; Supplier 1 Link: https://www.digikey.com/product-detail/en/samsung-electro-mechanics/CL21F104ZBCNNNC/1276-1007-1-ND/3889093
D2 = 150080VS75000: WL-SMCW SMT Mono-color Chip LED Waterclear, size 0805, Bright Green, 2V, 140deg; Chip Technology: AlInGaP; Dominant Wavelength typ.: 570nm; Luminous Intensity typ.: 40mcd; Peak Wavelength typ.: 572nm; Viewing Angle: 140deg; ComponentLink1Description: Manufacturer; ComponentLink1URL: http://www.we-online.de; ComponentLink2URL: https://www.we-online.com/catalog/datasheet/150080VS75000.pdf; ComponentLink2Description: Datasheet; Forward Voltage typ.: 2V; Emitting Color: Bright Green; Mounting Technology: SMT; Operating Temperature: -40 to +85degC; Published Date: December 2019; Part Number: 150080VS75000; Packaging: Tape and Reel; Size: 0805; Publisher: Wurth Elektronik
D3 = 150080YS75000: WL-SMCW SMT Mono-color Chip LED Waterclear, size 0805, Yellow, 2V, 140deg; Chip Technology: AlInGaP; Dominant Wavelength typ.: 590nm; Luminous Intensity typ.: 120mcd; Peak Wavelength typ.: 595nm; Viewing Angle: 140deg; ComponentLink1Description: Manufacturer; ComponentLink1URL: http://www.we-online.de; ComponentLink2URL: https://www.we-online.com/catalog/datasheet/150080YS75000.pdf; ComponentLink2Description: Datasheet; Forward Voltage typ.: 2V; Emitting Color: Yellow; Mounting Technology: SMT; Operating Temperature: -40 to +85degC; Published Date: December 2019; Part Number: 150080YS75000; Packaging: Tape and Reel; Size: 0805; Publisher: Wurth Elektronik
D4 = 150080RS75000: as D1 on sheet MCU; Viewing Angle: 140deg; ComponentLink1Description: Manufacturer; ComponentLink1URL: http://www.we-online.de; ComponentLink2URL: https://www.we-online.com/catalog/datasheet/150080RS75000.pdf; ComponentLink2Description: Datasheet; Forward Voltage typ.: 2V; Emitting Color: Red; Mounting Technology: SMT; Operating Temperature: -40 to +85degC; Published Date: December 2019; Part Number: 150080RS75000; Packaging: Tape and Reel; Size: 0805; Publisher: Wurth Elektronik
P7#2 P8#2 = Header 3: Header, 3-Pin; LatestRevisionDate: 17-Jul-2002; LatestRevisionNote: Re-released for DXP Platform.; Publisher: Altium Limited
R17 = Res-2.2K-0805: RES SMD 2.2K OHM 1% 1/8W 0805; Manufacturer: TE Connectivity Passive Product; Manufacturer Part Number: CRG0805F2K2; Local Supplier: thegioiic; Local Supplier Link: https://thegioiic.com/products/dien-tro-2-2k-ohm-0805-5; Supplier 1: Digikey; Supplier 1 Link: https://www.digikey.com/product-detail/en/te-connectivity-passive-product/CRG0805F2K2/A106060CT-ND/3477706; Supplier 1 Part Number: A106060CT-ND
R18 R19 R21 = Res-470-0805: RES 470 OHM JUMPER 0805; Manufacturer: YAG6006CT-ND; Manufacturer Part Number: PE0805FRF7W0R047L; Local Supplier: thegioiic; Local Supplier Link: https://www.thegioiic.com/products/dien-tro-470-kohm-0805-5; Supplier 1: Digikey; Supplier 1 Link: https://www.digikey.com/product-detail/en/yageo/PE0805FRF7W0R047L/YAG6006CT-ND/9696460; Supplier 1 Part Number: YAG6006CT-ND
R20 = Res-10k-0805: as R1 on sheet MCU; Local Supplier: thegioiic; Local Supplier Link: https://thegioiic.com/products/dien-tro-10k-ohm-0805-5; Supplier 1: Digikey; Supplier 1 Link: https://www.digikey.com/product-detail/en/stackpole-electronics-inc/RNCP0805FTD10K0/RNCP0805FTD10K0CT-ND/2240601; Supplier 1 Part Number: RNCP0805FTD10K0CT-ND
S#1 = 434113043826: SWITCH TACTILE SPST-NO 0.05A 12V; MF: WÃ¼rth Elektronik; Package: None; Value: *; MP: 434113043826; Availability: Unavailable; SnapEDA_Link: https://www.snapeda.com/parts/434113043826/W%C3%BCrth%20Elektronik/view-part/4797567/?ref=snap; Price: None
H1 = HC-05-06-TH: Local Supplier: HShop; Local Supplier Link: https://hshop.vn/products/mach-thu-phat-bluetooth-hc-06-do-ra-chon-slave; Local Supplier Part Number: HS000882; Manufacturer: *; Manufacturer Part Number: *
M4 = HC-05-06-SMD: Local Supplier: HShop; Local Supplier Link: https://hshop.vn/products/mach-thu-phat-bluetooth-hc-06-chua-ra-chon-slave; Local Supplier Part Number: HS000881; Manufacturer: *; Manufacturer Part Number: *

## Sheet RF.SchDoc
size A4
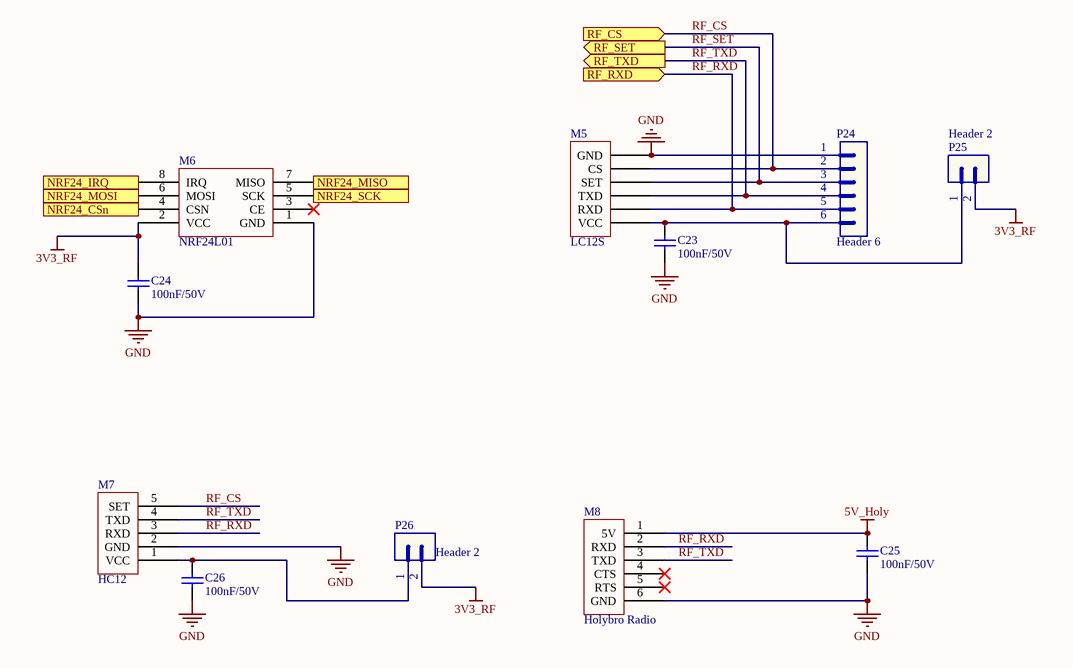
[diagram p5: RF.SchDoc]

### Parts
C23  value 100nF/50V  [CAP-SM-0805]  (hidden comment: Cap-100nF-50V-0805)
C24  value 100nF/50V  [CAP-SM-0805]  (hidden comment: Cap-100nF-50V-0805)
C25  value 100nF/50V  [CAP-SM-0805]  (hidden comment: Cap-100nF-50V-0805)
C26  value 100nF/50V  [CAP-SM-0805]  (hidden comment: Cap-100nF-50V-0805)
M5  LC12S  [LC12S]
M6  NRF24L01  [NRF24L01]
M7  HC12  [HC12]
M8  Holybro Radio  [Holybro-RADIO]
P24  Header 6  [JP6]
P25  Header 2  [JP2]
P26  Header 2  [JP2]

### Ports
NRF24_CSn (in), NRF24_IRQ (out), NRF24_MISO (out), NRF24_MOSI (in), NRF24_SCK (in), RF_CS (in), RF_RXD (in), RF_SET (out), RF_TXD (out)

### Nets
3V3_RF: C24.2 M6.2(VCC) P25.2 P26.2
5V_Holy: C25.2 M8.1(5V)  [project net 5V]
GND: C23.1 C24.1 C25.1 C26.1 M5.6(GND) M6.1(GND) M7.2(GND) M8.6(GND) P24.1
RF_CS: M5.5(CS) M7.5(SET) P24.2 ; port RF_CS
RF_RXD: M5.2(RXD) M7.3(RXD) M8.2(RXD) P24.5 ; port RF_RXD
RF_SET: M5.4(SET) P24.3 ; port RF_SET
RF_TXD: M5.3(TXD) M7.4(TXD) M8.3(TXD) P24.4 ; port RF_TXD
NetC23_2: C23.2 M5.1(VCC) P24.6 P25.1
NetC26_2: C26.2 M7.1(VCC) P26.1
NetM6_4: M6.4(CSN) ; port NRF24_CSn
NetM6_5: M6.5(SCK) ; port NRF24_SCK
NetM6_6: M6.6(MOSI) ; port NRF24_MOSI
NetM6_7: M6.7(MISO) ; port NRF24_MISO
NetM6_8: M6.8(IRQ) ; port NRF24_IRQ

Not connected (* = marked no-connect by the designer): M6 3(CE)*; M8 4(CTS)* 5(RTS)*

### Library data of the parts
C23-C26 = Cap-100nF-50V-0805: as C13 on sheet power_supply; Local Supplier: thegioiic; Local Supplier Link: https://thegioiic.com/products/tu-100nf-0-1uf-50v-0805; Supplier 1: Digikey; Supplier 1 Part Number: 1276-1007-1-ND; Supplier 1 Link: https://www.digikey.com/product-detail/en/samsung-electro-mechanics/CL21F104ZBCNNNC/1276-1007-1-ND/3889093
P24 = Header 6: Header, 6-Pin; LatestRevisionDate: 17-Jul-2002; LatestRevisionNote: Re-released for DXP Platform.; Publisher: Altium Limited
P25 P26 = Header 2: Header, 2-Pin; LatestRevisionDate: 17-Jul-2002; LatestRevisionNote: Re-released for DXP Platform.; Publisher: Altium Limited
M5 = LC12S: Local Supplier: HShop; Local Supplier Link: https://hshop.vn/products/mach-thu-phat-rf-uart-lc12s-2-4ghz?fbclid=IwAR26O0qUYvAaxZyOD_fV7zzf2od6t2O22eUH8MkuJUU9SmcdCCf5BpKqTRM; Local Supplier Part Number: HS000895; Manufacturer: *; Manufacturer Part Number: *
M6 = NRF24L01: Local Supplier: HShop; Local Supplier Link: https://hshop.vn/products/mach-thu-phat-rf-nrf24l01-pa-lna-nrf-e04; Local Supplier Part Number: HS000888; Manufacturer: *; Manufacturer Part Number: *
M7 = HC12: Local Supplier: HShop; Local Supplier Link: https://hshop.vn/products/mach-thu-phat-rf-uart-si4463-433mhzkhoang-coch-1km; Local Supplier Part Number: HS000897; Manufacturer: *; Manufacturer Part Number: *
M8 = Holybro Radio: Local Supplier: HShop; Local Supplier Link: *; Local Supplier Part Number: *; Manufacturer: *; Manufacturer Part Number: *

## Sheet Decawave.SchDoc
size A4
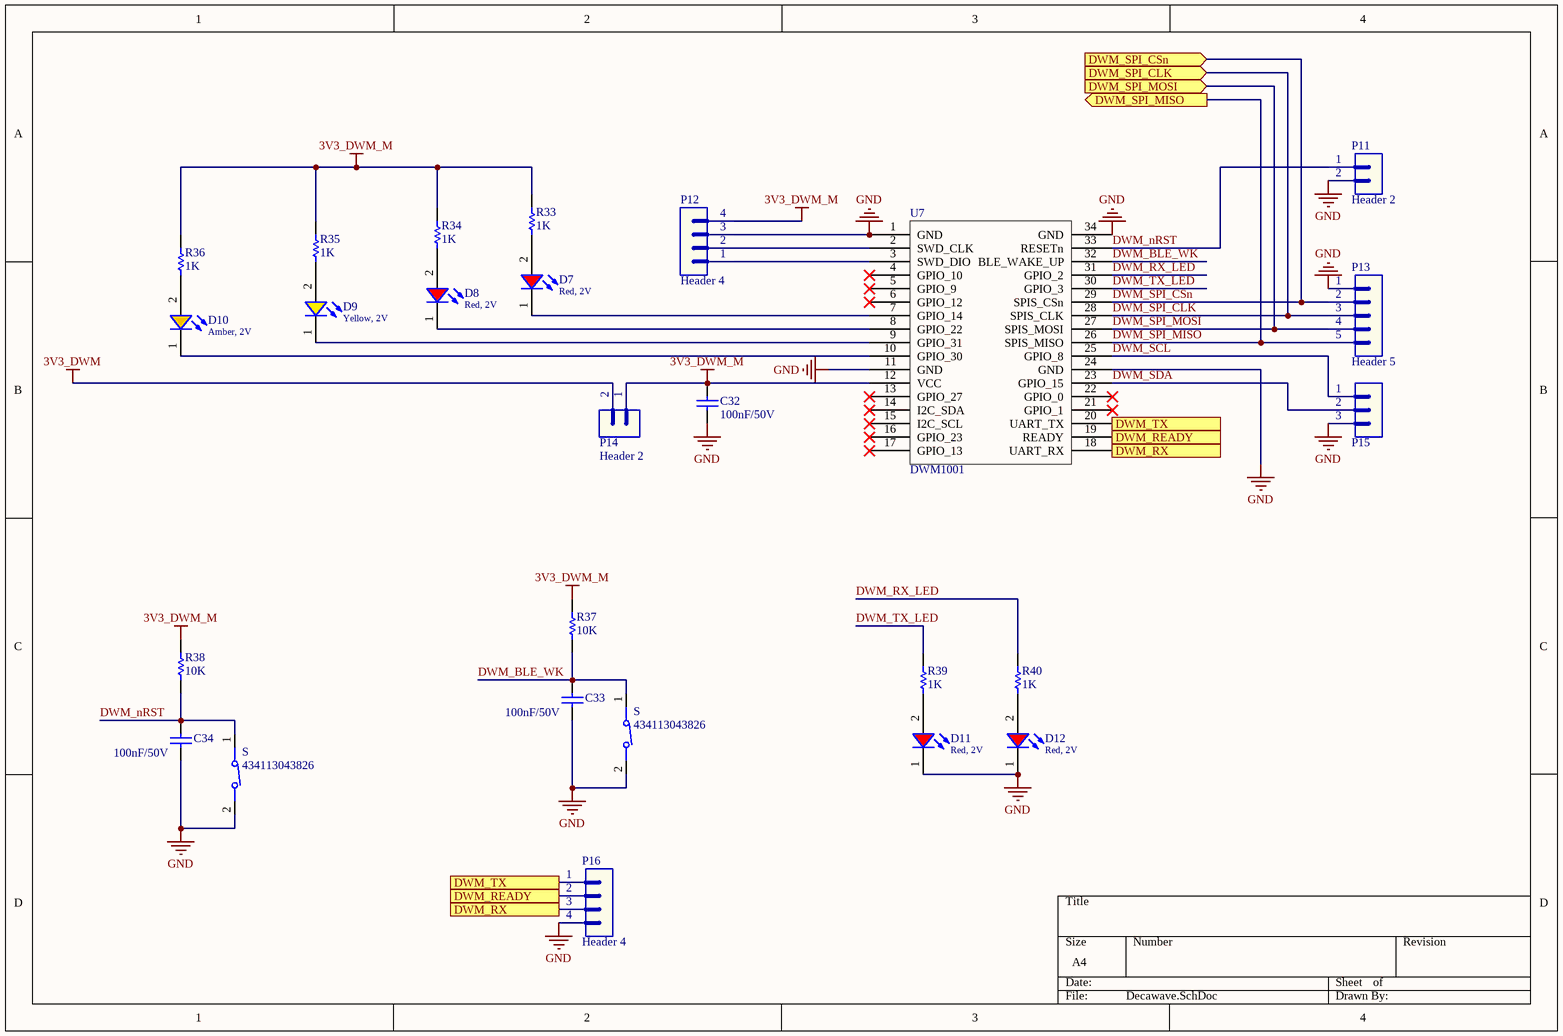
[diagram p6: Decawave.SchDoc]

### Parts
(Parts that share a designator on the sheet are numbered #1, #2 ... from top to bottom, then left to right.)
C32#1  value 100nF/50V  [CAP-SM-0805]  (hidden comment: Cap-100nF-50V-0805)
C33#1  value 100nF/50V  [CAP-SM-0805]  (hidden comment: Cap-100nF-50V-0805)
C34#1  value 100nF/50V  [CAP-SM-0805]  (hidden comment: Cap-100nF-50V-0805)
D7  Red, 2V  [WL-SMCW_0603_H=0.7mm]
D8  Red, 2V  [WL-SMCW_0603_H=0.7mm]
D9  Yellow, 2V  [WL-SMCW_0603_H=0.25mm]
D10#1  Amber, 2V  [WL-SMCW_0603_H=0.7mm]
D11#1  Red, 2V  [WL-SMCW_0603_H=0.7mm]
D12  Red, 2V  [WL-SMCW_0603_H=0.7mm]
P11  Header 2  [JP2]
P12  Header 4  [JP4]
P13  Header 5  [JP5]
P14  Header 2  [JP2]
P15  Header 3  [JP3]  (value not drawn)
P16  Header 4  [JP4]
R33#1  value 1K  [RES-SM-0805]  (hidden comment: Res-1K-0805)
R34#1  value 1K  [RES-SM-0805]  (hidden comment: Res-1K-0805)
R35#1  value 1K  [RES-SM-0805]  (hidden comment: Res-1K-0805)
R36#1  value 1K  [RES-SM-0805]  (hidden comment: Res-1K-0805)
R37  value 10K  [RES-SM-0805]  (hidden comment: Res-10k-0805)
R38  value 10K  [RES-SM-0805]  (hidden comment: Res-10k-0805)
R39  value 1K  [RES-SM-0805]  (hidden comment: Res-1K-0805)
R40  value 1K  [RES-SM-0805]  (hidden comment: Res-1K-0805)
S#2  434113043826  [434113043826]
S#3  434113043826  [434113043826]
U7  DWM1001  [DWM1001]

### Ports
DWM_READY (in), DWM_READY (out), DWM_RX (in), DWM_RX (out), DWM_SPI_CLK (in), DWM_SPI_CSn (in), DWM_SPI_MISO (out), DWM_SPI_MOSI (in), DWM_TX (in), DWM_TX (out)

### Nets
3V3_DWM: P14.2
3V3_DWM_M: C32#1.2 P12.4 P14.1 R33#1.2 R34#1.2 R35#1.2 R36#1.2 R37.2 R38.2 U7.12(VCC)
GND: C32#1.1 C33#1.1 C34#1.1 D11#1.1(K) D12.1(K) P11.2 P12.3 P13.1 P15.3 P16.4 S#2.2 S#3.2 U7.1(GND) U7.11(GND) U7.24(GND) U7.34(GND)
DWM_BLE_WK: C33#1.2 R37.1 S#2.1 U7.32(BLE_WAKE_UP)
DWM_nRST: C34#1.2 P11.1 R38.1 S#3.1 U7.33(RESETn)
DWM_RX_LED: R40.2 U7.31(GPIO_2)
DWM_SCL: P15.1 U7.25(GPIO_8)
DWM_SDA: P15.2 U7.23(GPIO_15)
DWM_SPI_CLK: P13.3 U7.28(SPIS_CLK) ; port DWM_SPI_CLK
DWM_SPI_CSn: P13.2 U7.29(SPIS_CSn) ; port DWM_SPI_CSn
DWM_SPI_MISO: P13.5 U7.26(SPIS_MISO) ; port DWM_SPI_MISO
DWM_SPI_MOSI: P13.4 U7.27(SPIS_MOSI) ; port DWM_SPI_MOSI
DWM_TX_LED: R39.2 U7.30(GPIO_3)
NetD7_1: D7.1(K) U7.7(GPIO_14)
NetD7_2: D7.2(A) R33#1.1
NetD8_1: D8.1(K) U7.8(GPIO_22)
NetD8_2: D8.2(A) R34#1.1
NetD9_1: D9.1(K) U7.9(GPIO_31)
NetD9_2: D9.2(A) R35#1.1
NetD10#1_1: D10#1.1(K) U7.10(GPIO_30)
NetD10#1_2: D10#1.2(A) R36#1.1
NetD11#1_2: D11#1.2(A) R39.1
NetD12_2: D12.2(A) R40.1
NetP12_1: P12.1 U7.3(SWD_DIO)
NetP12_2: P12.2 U7.2(SWD_CLK)
NetP16_1: P16.1 U7.20(UART_TX) ; port DWM_TX
NetP16_2: P16.2 U7.19(READY) ; port DWM_READY
NetP16_3: P16.3 U7.18(UART_RX) ; port DWM_RX

Not connected (* = marked no-connect by the designer): U7 4(GPIO_10)* 5(GPIO_9)* 6(GPIO_12)* 13(GPIO_27)* 14(I2C_SDA)* 15(I2C_SCL)* 16(GPIO_23)* 17(GPIO_13)* 21(GPIO_1)* 22(GPIO_0)*

### Library data of the parts
C32#1 C33#1 C34#1 = Cap-100nF-50V-0805: as C13 on sheet power_supply; Local Supplier: thegioiic; Local Supplier Link: https://thegioiic.com/products/tu-100nf-0-1uf-50v-0805; Supplier 1: Digikey; Supplier 1 Part Number: 1276-1007-1-ND; Supplier 1 Link: https://www.digikey.com/product-detail/en/samsung-electro-mechanics/CL21F104ZBCNNNC/1276-1007-1-ND/3889093
D7 D8 D11#1 D12 = 150060RS75000: WL-SMCW SMT Mono-color Chip LED Waterclear, size 0603, Red, 2V, 140deg; Chip Technology: AlInGaP; Dominant Wavelength typ.: 625nm; Luminous Intensity typ.: 250mcd; Peak Wavelength typ.: 630nm; Viewing Angle: 140deg; ComponentLink1Description: Manufacturer; ComponentLink1URL: http://www.we-online.de; ComponentLink2URL: https://www.we-online.com/catalog/datasheet/150060RS75000.pdf; ComponentLink2Description: Datasheet; Forward Voltage typ.: 2V; Emitting Color: Red; Mounting Technology: SMT; Operating Temperature: -40 to +85degC; Published Date: December 2019; Part Number: 150060RS75000; Packaging: Tape and Reel; Size: 0603; Publisher: Wurth Elektronik
D9 = 150060YS75020: WL-SMCW SMT Mono-color Chip LED Waterclear, size 0603, Yellow, 2V, 140deg; Chip Technology: AlInGaP; Dominant Wavelength typ.: 590nm; Luminous Intensity typ.: 130mcd; Peak Wavelength typ.: 595nm; Viewing Angle: 140deg; ComponentLink1Description: Manufacturer; ComponentLink1URL: http://www.we-online.de; ComponentLink2URL: https://www.we-online.com/catalog/datasheet/150060YS75020.pdf; ComponentLink2Description: Datasheet; Forward Voltage typ.: 2V; Emitting Color: Yellow; Mounting Technology: SMT; Operating Temperature: -40 to +85degC; Published Date: March 2020; Part Number: 150060YS75020; Packaging: Tape and Reel; Size: 0603; Publisher: Wurth Elektronik
D10#1 = 150060AS75000: WL-SMCW SMT Mono-color Chip LED Waterclear, size 0603, Amber, 2V, 140deg; Chip Technology: AlInGaP; Dominant Wavelength typ.: 605nm; Luminous Intensity typ.: 130mcd; Peak Wavelength typ.: 610nm; Viewing Angle: 140deg; ComponentLink1Description: Manufacturer; ComponentLink1URL: http://www.we-online.de; ComponentLink2URL: https://www.we-online.com/catalog/datasheet/150060AS75000.pdf; ComponentLink2Description: Datasheet; Forward Voltage typ.: 2V; Emitting Color: Amber; Mounting Technology: SMT; Operating Temperature: -40 to +85degC; Published Date: December 2019; Part Number: 150060AS75000; Packaging: Tape and Reel; Size: 0603; Publisher: Wurth Elektronik
P11 P14 = Header 2: Header, 2-Pin; LatestRevisionDate: 17-Jul-2002; LatestRevisionNote: Re-released for DXP Platform.; Publisher: Altium Limited
P12 P16 = Header 4: Header, 4-Pin; LatestRevisionDate: 17-Jul-2002; LatestRevisionNote: Re-released for DXP Platform.; Publisher: Altium Limited
P13 = Header 5: Header, 5-Pin; LatestRevisionDate: 17-Jul-2002; LatestRevisionNote: Re-released for DXP Platform.; Publisher: Altium Limited
P15 = Header 3: Header, 3-Pin; LatestRevisionDate: 17-Jul-2002; LatestRevisionNote: Re-released for DXP Platform.; Publisher: Altium Limited
R33#1 R34#1 R35#1 R36#1 R39 R40 = Res-1K-0805: as R6 on sheet MCU; Local Supplier: thegioiic; Local Supplier Link: https://thegioiic.com/products/dien-tro-1k-ohm-0805-5; Supplier 1: Digikey; Supplier 1 Link: https://www.digikey.com/product-detail/en/stackpole-electronics-inc/RNCP0805FTD1K00/RNCP0805FTD1K00CT-ND/2240568; Supplier 1 Part Number: RNCP0805FTD1K00CT-ND
R37 R38 = Res-10k-0805: as R1 on sheet MCU; Local Supplier: thegioiic; Local Supplier Link: https://thegioiic.com/products/dien-tro-10k-ohm-0805-5; Supplier 1: Digikey; Supplier 1 Link: https://www.digikey.com/product-detail/en/stackpole-electronics-inc/RNCP0805FTD10K0/RNCP0805FTD10K0CT-ND/2240601; Supplier 1 Part Number: RNCP0805FTD10K0CT-ND
S#2 S#3 = 434113043826: as S#1 on sheet Bluetooth; Package: None; Value: *; MP: 434113043826; Availability: Unavailable; SnapEDA_Link: https://www.snapeda.com/parts/434113043826/W%C3%BCrth%20Elektronik/view-part/4797567/?ref=snap; Price: None
U7 = DWM1001: Local Supplier: *; Local Supplier Link: *; Local Supplier Part Number: *; Manufacturer: *; Manufacturer Part Number: *

## Sheet Wifi.SchDoc
size A4
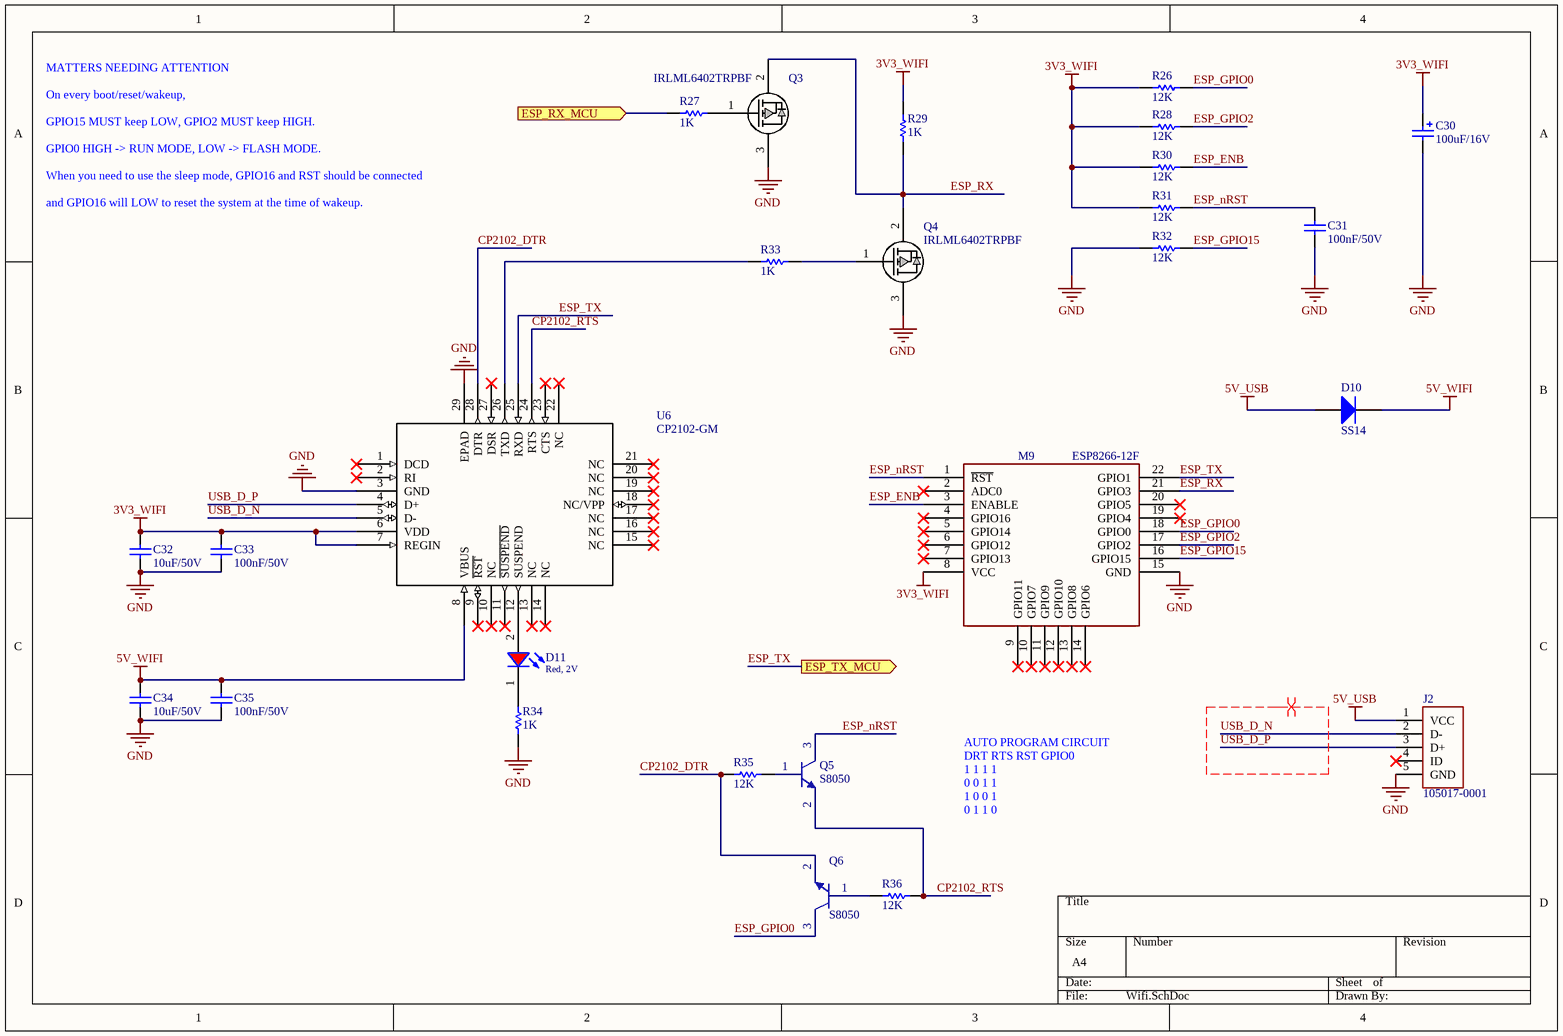
[diagram p7: Wifi.SchDoc]

### Parts
(Parts that share a designator on the sheet are numbered #1, #2 ... from top to bottom, then left to right.)
C30  value 100uF/16V  [CAP_SM_TAN]  (hidden comment: TAJB107M006RNJ)
C31  value 100nF/50V  [CAP-SM-0805]  (hidden comment: Cap-100nF-50V-0805)
C32#2  value 10uF/50V  [CAP-SM-0805]  (hidden comment: Cap-10uF-50V-0805)
C33#2  value 100nF/50V  [CAP-SM-0805]  (hidden comment: Cap-100nF-50V-0805)
C34#2  value 10uF/50V  [CAP-SM-0805]  (hidden comment: Cap-10uF-50V-0805)
C35  value 100nF/50V  [CAP-SM-0805]  (hidden comment: Cap-100nF-50V-0805)
D10#2  SS14  [SS14]
D11#2  Red, 2V  [WL-SMCW_0805]
J2  105017-0001  [CONN_105017-0001]
M9  ESP8266-12F  [ESP8266-12F]
Q3  IRLML6402TRPBF  [IRLML6402TRPBF]
Q4  IRLML6402TRPBF  [IRLML6402TRPBF]
Q5  S8050  [SOT23_NEX]
Q6  S8050  [SOT23_NEX]
R26  value 12K  [RES-SM-0805]  (hidden comment: Res-12K-0805)
R27  value 1K  [RES-SM-0805]  (hidden comment: Res-1K-0805)
R28  value 12K  [RES-SM-0805]  (hidden comment: Res-12K-0805)
R29  value 1K  [RES-SM-0805]  (hidden comment: Res-1K-0805)
R30  value 12K  [RES-SM-0805]  (hidden comment: Res-12K-0805)
R31  value 12K  [RES-SM-0805]  (hidden comment: Res-12K-0805)
R32  value 12K  [RES-SM-0805]  (hidden comment: Res-12K-0805)
R33#2  value 1K  [RES-SM-0805]  (hidden comment: Res-1K-0805)
R34#2  value 1K  [RES-SM-0805]  (hidden comment: Res-1K-0805)
R35#2  value 12K  [RES-SM-0805]  (hidden comment: Res-12K-0805)
R36#2  value 12K  [RES-SM-0805]  (hidden comment: Res-12K-0805)
U6  CP2102-GM  [CP2102-GM]

### Ports
ESP_RX_MCU (in), ESP_TX_MCU (out)

### Nets
3V3_WIFI: C30.1 C32#2.2 C33#2.1 M9.8(VCC) R26.1 R28.1 R29.2 R30.1 R31.1 U6.6(VDD) U6.7(REGIN)
5V_USB: D10#2.2(A) J2.1(VCC)
5V_WIFI: C34#2.2 C35.1 D10#2.1(K) U6.8(VBUS)
GND: C30.2 C31.2 C32#2.1 C33#2.2 C34#2.1 C35.2 J2.5(GND) M9.15(GND) Q3.3(S) Q4.3(S) R32.1 R34#2.1 U6.3(GND) U6.29(EPAD)
CP2102_DTR: Q6.2(E) R35#2.1 U6.28(DTR)
CP2102_RTS: Q5.2(E) R36#2.2 U6.24(RTS)
ESP_ENB: M9.3(ENABLE) R30.2
ESP_GPIO0: M9.18(GPIO0) Q6.3(C) R26.2
ESP_GPIO2: M9.17(GPIO2) R28.2
ESP_GPIO15: M9.16(GPIO15) R32.2
ESP_nRST: C31.1 M9.1(~{RST}) Q5.3(C) R31.2
ESP_RX: M9.21(GPIO3) Q3.2(D) Q4.2(D) R29.1
ESP_TX: M9.22(GPIO1) U6.25(RXD) ; port ESP_TX_MCU
USB_D_N: J2.2(D-) U6.5(D-)
USB_D_P: J2.3(D+) U6.4(D+)
NetD11#2_1: D11#2.1(K) R34#2.2
NetD11#2_2: D11#2.2(A) U6.12(SUSPEND)
NetQ3_1: Q3.1(G) R27.2
NetQ4_1: Q4.1(G) R33#2.2
NetQ5_1: Q5.1(B) R35#2.2
NetQ6_1: Q6.1(B) R36#2.1
NetR27_1: R27.1 ; port ESP_RX_MCU
NetR33#2_1: R33#2.1 U6.26(TXD)

Not connected (* = marked no-connect by the designer): J2 4(ID)*; M9 2(ADC0)* 4(GPIO16)* 5(GPIO14)* 6(GPIO12)* 7(GPIO13)* 9(GPIO11)* 10(GPIO7)* 11(GPIO9)* 12(GPIO10)* 13(GPIO8)* 14(GPIO6)* 19(GPIO4)* 20(GPIO5)*; U6 1(DCD)* 2(RI)* 9(~{RST})* 10(NC)* 11(~{SUSPEND})* 13(NC)* 14(NC)* 15(NC)* 16(NC)* 17(NC)* 18(NC/VPP)* 19(NC)* 20(NC)* 21(NC)* 22(NC)* 23(CTS)* 27(DSR)*

### Layout directives
differential pair: USB_D_N, USB_D_P

### Notes on the sheet
- MATTERS NEEDING ATTENTION
- On every boot/reset/wakeup,
- GPIO15 MUST keep LOW, GPIO2 MUST keep HIGH.
- GPIO0 HIGH -> RUN MODE, LOW -> FLASH MODE.
- When you need to use the sleep mode, GPIO16 and RST should be connected
- and GPIO16 will LOW to reset the system at the time of wakeup.
- AUTO PROGRAM CIRCUIT
  DRT RTS RST GPIO0
  1 1 1 1
  0 0 1 1
  1 0 0 1
  0 1 1 0

### Library data of the parts
C30 = Cap-Tan-100uF-16V: Manufacturer: Nichicon; Manufacturer Part Number: UWX1C101MCL1GB; Local Supplier: icdayroi; Local Supplier Link: https://icdayroi.com/tu-tantalum-100uf-16v-smd6032; Supplier 1: Digikey; Supplier 1 Part Number: 493-2105-1-ND; Supplier 1 Link: https://www.digikey.com/product-detail/en/nichicon/UWX1C101MCL1GB/493-2105-1-ND/590080
C31 C33#2 C35 = Cap-100nF-50V-0805: as C13 on sheet power_supply; Local Supplier: thegioiic; Local Supplier Link: https://thegioiic.com/products/tu-100nf-0-1uf-50v-0805; Supplier 1: Digikey; Supplier 1 Part Number: 1276-1007-1-ND; Supplier 1 Link: https://www.digikey.com/product-detail/en/samsung-electro-mechanics/CL21F104ZBCNNNC/1276-1007-1-ND/3889093
C32#2 C34#2 = Cap-10uF-50V-0805: as C7 on sheet power_supply; Local Supplier: thegioiic; Local Supplier Link: https://thegioiic.com/products/tu-10uf-50v-0805; Supplier 1: Digikey; Supplier 1 Link: https://www.digikey.com/product-detail/en/yageo/CC0805KKX5R9BB106/311-3499-2-ND/7164383; Supplier 1 Part Number: 311-3499-2-ND
D10#2 = Diode-SS14: DIODE SCHOTTKY 40V 1A SMA; Manufacturer: ON Semiconductor; Local Supplier: thegioiic; Local Supplier Link: https://thegioiic.com/products/ss14-sma; Supplier 1: Digikey; Supplier 1 Link: https://www.digikey.com/product-detail/en/on-semiconductor/SS14/SS14CT-ND/965729; Manufacturer Part Number: SS14; Supplier 1 Part Number: SS14CT-ND
D11#2 = 150080RS75000: as D1 on sheet MCU; Viewing Angle: 140deg; ComponentLink1Description: Manufacturer; ComponentLink1URL: http://www.we-online.de; ComponentLink2URL: https://www.we-online.com/catalog/datasheet/150080RS75000.pdf; ComponentLink2Description: Datasheet; Forward Voltage typ.: 2V; Emitting Color: Red; Mounting Technology: SMT; Operating Temperature: -40 to +85degC; Published Date: December 2019; Part Number: 150080RS75000; Packaging: Tape and Reel; Size: 0805; Publisher: Wurth Elektronik
J2 = 105017-0001: No Description Available; Vendor: Molex Connector Corporation; Built_By: EMA_Cory; SourceLibrary: Molex_2020-05-26; Datasheet: https://www.molex.com/pdm_docs/sd/1050170001_sd.pdf; Manufacturer_Part_Number: 105017-0001; Copyright: Copyright (C) 2018 Accelerated Designs. All rights reserved; RefDes: RefDes; Type: DEV
Q3 Q4 = IRLML6402TRPBF: Source_Library: Infineon_2020-02-27.xlr; Built_By: EMA_Justin; SourceLibrary: Infineon_2020-02-27; Vendor: Infineon; Type: DEV; Copyright: Copyright (C) 2018 Accelerated Designs. All rights reserved; Manufacturer_Part_Number: IRLML6402TRPBF; RefDes: RefDes
R26 R28 R30-R32 R35#2 R36#2 = Res-12K-0805: RES 12 KOHM JUMPER 0805; Manufacturer: Vishay Thin Film; Manufacturer Part Number: PAT0805E3121BST1; Local Supplier: icdayroi; Local Supplier Link: https://icdayroi.com/dien-tro-12k-0805-1-goi-50-con; Supplier 1: Digikey; Supplier 1 Link: https://www.digikey.com/product-detail/en/vishay-thin-film/PAT0805E3121BST1/PAT0805E3121BST1-ND/2281536; Supplier 1 Part Number: PAT0805E3121BST1-ND
R27 R29 R33#2 R34#2 = Res-1K-0805: as R6 on sheet MCU; Local Supplier: thegioiic; Local Supplier Link: https://thegioiic.com/products/dien-tro-1k-ohm-0805-5; Supplier 1: Digikey; Supplier 1 Link: https://www.digikey.com/product-detail/en/stackpole-electronics-inc/RNCP0805FTD1K00/RNCP0805FTD1K00CT-ND/2240568; Supplier 1 Part Number: RNCP0805FTD1K00CT-ND
U6 = CP2102-GM: Manufacturer_Part_Number: CP2102-GMR; Vendor: Silicon Labs; Built_By: EMA_UL_Team; SourceLibrary: Silicon_Labs_2015-03-23; Copyright: Copyright (C) 2018 Accelerated Designs. All rights reserved; RefDes: RefDes; Type: DEV
M9 = ESP8266-12F: Local Supplier: HShop; Local Supplier Link: https://hshop.vn/products/mach-thu-phat-wifi-soc-esp8266-v12; Local Supplier Part Number: HS000912; Manufacturer: *; Manufacturer Part Number: *

## Nets that join several sheets
3V3_BLU: power_supply (C15.2 IC4.2 IC4.4), Bluetooth (M4.12 S#1.1)
3V3_DWM: power_supply (C12.2 IC3.2 IC3.4), Decawave (P14.2)
3V3_MC: power_supply (C10.2 C11.2 IC2.2 IC2.4), MCU (12 pins), Sensor (6 pins), Motor Control (11 pins)
3V3_RF: power_supply (C14.2 U2.5), RF (C24.2 M6.2 P25.2 P26.2)
3V3_WIFI: power_supply (C9.2 IC1.2 IC1.4), Wifi (11 pins)
5V: power_supply (10 pins), MCU (BZ1.1 J1.1), Motor Control (P6#2.3), Bluetooth (C21.2 H1.5), RF (C25.2 M8.1)
5V_WIFI: power_supply (IC1.3 P6#1.2), Wifi (C34#2.2 C35.1 D10#2.1 U6.8)
12V: power_supply (C6.1 C7.2 P4#1.1 PI1.1), Motor Control (P4#2.1 P5#2.1)
GND: power_supply (19 pins), MCU (16 pins), Sensor (6 pins), Motor Control (11 pins), Bluetooth (10 pins), RF (9 pins), Decawave (16 pins), Wifi (14 pins)
DWM_SPI_CLK: MCU (U1.26), Decawave (P13.3 U7.28)
DWM_SPI_CSn: MCU (U1.25), Decawave (P13.2 U7.29)
DWM_SPI_MISO: MCU (U1.27), Decawave (P13.5 U7.26)
DWM_SPI_MOSI: MCU (U1.28), Decawave (P13.4 U7.27)
ESP_TX: MCU (U1.13), Wifi (M9.22 U6.25)
NetH1_2: MCU (U1.30), Bluetooth (H1.2 M4.2 P8#2.2)
NetH1_3: MCU (U1.31), Bluetooth (H1.3 M4.1 P8#2.1)
NetH1_6: MCU (U1.32), Bluetooth (H1.6 R17.2 S#1.2)
NetM1_3: MCU (U1.45), Sensor (M1.3)
NetM1_4: MCU (U1.46), Sensor (M1.4)
NetM6_4: MCU (U1.38), RF (M6.4)
NetM6_5: MCU (U1.39), RF (M6.5)
NetM6_6: MCU (U1.41), RF (M6.6)
NetM6_7: MCU (U1.40), RF (M6.7)
NetM6_8: MCU (U1.33), RF (M6.8)
NetR8_1: power_supply (R8.1), MCU (U1.15)
NetR27_1: MCU (U1.12), Wifi (R27.1)
NetU1_3: MCU (U1.3), Motor Control (U5.3)
NetU1_4: MCU (U1.4), Motor Control (U5.6)
NetU1_5: MCU (U1.5), Motor Control (U5.5)
NetU1_6: MCU (U1.6), Motor Control (U5.7)
NetU1_10: MCU (U1.10), Motor Control (U5.2)
NetU1_11: MCU (U1.11), Motor Control (U5.4)
NetU1_16: MCU (U1.16), Sensor (U3.2)
NetU1_17: MCU (U1.17), Sensor (U3.4)
NetU1_42: MCU (U1.42), Sensor (U3.8)
NetU1_43: MCU (U1.43), Sensor (U3.6)
RF_RXD: MCU (U1.21), RF (M5.2 M7.3 M8.2 P24.5)
RF_SET: MCU (U1.19), RF (M5.4 P24.3)
RF_TXD: MCU (U1.22), RF (M5.3 M7.4 M8.3 P24.4)